# EAGLE design temoin (EAGLE 9.6.2)
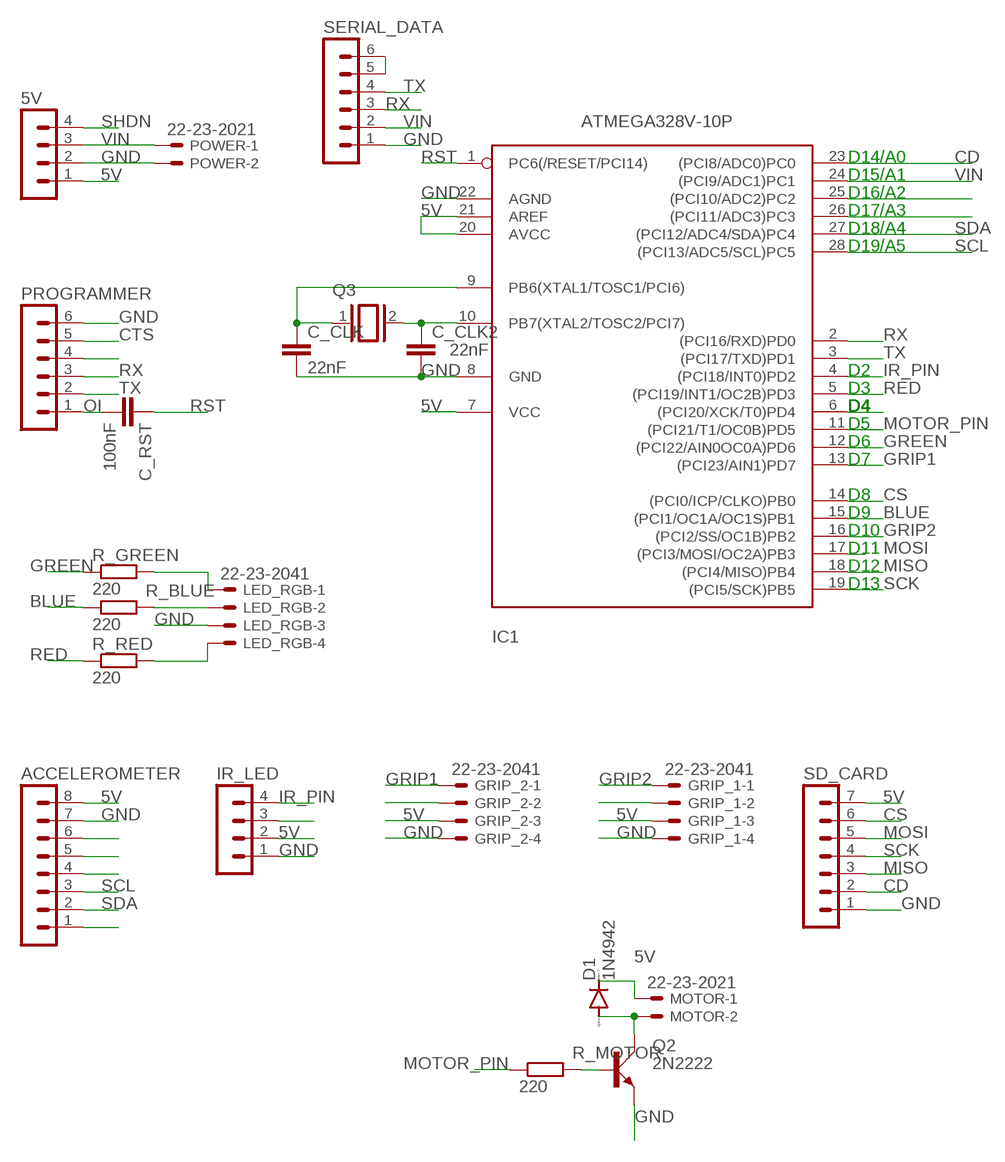
[diagram p0: schematic, sheet 1]

## Parts
5V  MA04-1  [MA04-1]
ACCELEROMETER  MA08-1  [MA08-1]
C_CLK  22nF  C-EU025-025X050  [C025-025X050]
C_CLK2  22nF  C-EU025-025X050  [C025-025X050]
C_RST  100nF  C-EU025-040X050  [C025-040X050]
D1  1N4942  [DO41-10]
GRIP_1  22-23-2041  [22-23-2041]
GRIP_2  22-23-2041  [22-23-2041]
IC1  ATMEGA328V-10P  [DIL28-3]
IR_LED  MA04-1  [MA04-1]
LED_RGB  22-23-2041  [22-23-2041]
MOTOR  22-23-2021  [22-23-2021]
POWER  22-23-2021  [22-23-2021]
PROGRAMMER  MA06-1  [MA06-1]
Q2  2N2222  [TO18A]
Q3  XTAL/S  [QS]
R_BLUE  220  R-EU_0411/12  [0411/12]
R_GREEN  220  R-EU_0411/12  [0411/12]
R_MOTOR  220  R-EU_0411/12  [0411/12]
R_RED  220  R-EU_0411/12  [0411/12]
SD_CARD  MA07-1  [MA07-1]
SERIAL_DATA  MA06-1  [MA06-1]

## Nets
5V: 5V.1 ACCELEROMETER.8 D1.C GRIP_1.3 GRIP_2.3 IC1.7(VCC) IC1.20(AVCC) IC1.21(AREF) IR_LED.2 MOTOR.1 SD_CARD.7
BLUE: IC1.15((PCI1/OC1A/OC1S)PB1) R_BLUE.1
CD: IC1.23((PCI8/ADC0)PC0) SD_CARD.2
CS: IC1.14((PCI0/ICP/CLKO)PB0) SD_CARD.6
CTS: PROGRAMMER.5
GND: 5V.2 ACCELEROMETER.7 C_CLK2.2 C_CLK.2 GRIP_1.4 GRIP_2.4 IC1.8(GND) IC1.22(AGND) IR_LED.1 LED_RGB.3 POWER.2 PROGRAMMER.6 Q2.E SD_CARD.1 SERIAL_DATA.1
GREEN: IC1.12((PCI22/AIN0OC0A)PD6) R_GREEN.1
GRIP1: GRIP_2.1 IC1.13((PCI23/AIN1)PD7)
GRIP2: GRIP_1.1 IC1.16((PCI2/SS/OC1B)PB2)
IR_PIN: IC1.4((PCI18/INT0)PD2) IR_LED.4
MISO: IC1.18((PCI4/MISO)PB4) SD_CARD.3
MOSI: IC1.17((PCI3/MOSI/OC2A)PB3) SD_CARD.5
MOTOR_PIN: IC1.11((PCI21/T1/OC0B)PD5) R_MOTOR.1
N$1: LED_RGB.2 R_BLUE.2
N$2: SERIAL_DATA.5 SERIAL_DATA.6
N$4: IC1.25((PCI10/ADC2)PC2)
N$5: IC1.26((PCI11/ADC3)PC3)
N$8: D1.A MOTOR.2 Q2.C
N$10: PROGRAMMER.4
N$13: Q2.B R_MOTOR.2
N$14: IC1.6((PCI20/XCK/T0)PD4)
N$16: ACCELEROMETER.6
N$17: ACCELEROMETER.5
N$18: ACCELEROMETER.4
N$21: ACCELEROMETER.1
N$23: GRIP_1.2
N$27: GRIP_2.2
N$30: C_CLK2.1 IC1.10(PB7(XTAL2/TOSC2/PCI7)) Q3.2
N$32: LED_RGB.1 R_GREEN.2
N$33: LED_RGB.4 R_RED.2
N$36: C_CLK.1 IC1.9(PB6(XTAL1/TOSC1/PCI6)) Q3.1
N$37: IR_LED.3
OI: C_RST.2 PROGRAMMER.1
RED: IC1.5((PCI19/INT1/OC2B)PD3) R_RED.1
RST: C_RST.1 IC1.1(PC6(/RESET/PCI14))
RX: IC1.2((PCI16/RXD)PD0) PROGRAMMER.3 SERIAL_DATA.3
SCK: IC1.19((PCI5/SCK)PB5) SD_CARD.4
SCL: ACCELEROMETER.3 IC1.28((PCI13/ADC5/SCL)PC5)
SDA: ACCELEROMETER.2 IC1.27((PCI12/ADC4/SDA)PC4)
SHDN: 5V.4
TX: IC1.3((PCI17/TXD)PD1) PROGRAMMER.2 SERIAL_DATA.4
VIN: 5V.3 IC1.24((PCI9/ADC1)PC1) POWER.1 SERIAL_DATA.2

## Notes on the sheet
- D14/A0
- D15/A1
- D16/A2
- D17/A3
- D18/A4
- D19/A5
- D2
- D3
- D4 | D4 | D4 | D4 | D4
- D5
- D6
- D7
- D8
- D9
- D10
- D11
- D12
- D13

## Library data of the parts
5V IR_LED = con-lstb:MA04-1: PIN HEADER; OC_FARNELL: unknown; OC_NEWARK: unknown
ACCELEROMETER = con-lstb:MA08-1: PIN HEADER; OC_FARNELL: unknown; OC_NEWARK: unknown
C_CLK C_CLK2 C_RST = rcl:C-EU: CAPACITOR, European symbol; SPICEPREFIX: C
D1 = diode:1N4942: DIODE 1.0 A, 200 V, 150 ns
GRIP_1 GRIP_2 LED_RGB = con-molex:22-23-2041: .100" (2.54mm) Center Header - 4 Pin; MF: MOLEX; MPN: 22-23-2041; OC_FARNELL: 1462920; OC_NEWARK: 38C0355
IC1 = atmega328:ATMEGA328*P: MICROCONTROLLER 32 kBytes FLASH 2 kBytes SRAM 1 kBytes EEPROM USART 8-channel 10 bit ADC
MOTOR POWER = con-molex:22-23-2021: .100" (2.54mm) Center Header - 2 Pin; MF: MOLEX; MPN: 22-23-2021; OC_FARNELL: 1462926; OC_NEWARK: 25C3832
PROGRAMMER SERIAL_DATA = con-lstb:MA06-1: PIN HEADER; OC_FARNELL: unknown; OC_NEWARK: unknown
Q2 = transistor-small-signal:2N2222: NPN TRANSISTOR
Q3 = special:XTAL/S: CRYSTAL
R_BLUE R_GREEN R_MOTOR R_RED = rcl:R-EU_: RESISTOR, European symbol; SPICEPREFIX: R
SD_CARD = con-lstb:MA07-1: PIN HEADER; OC_FARNELL: unknown; OC_NEWARK: unknown

## Board
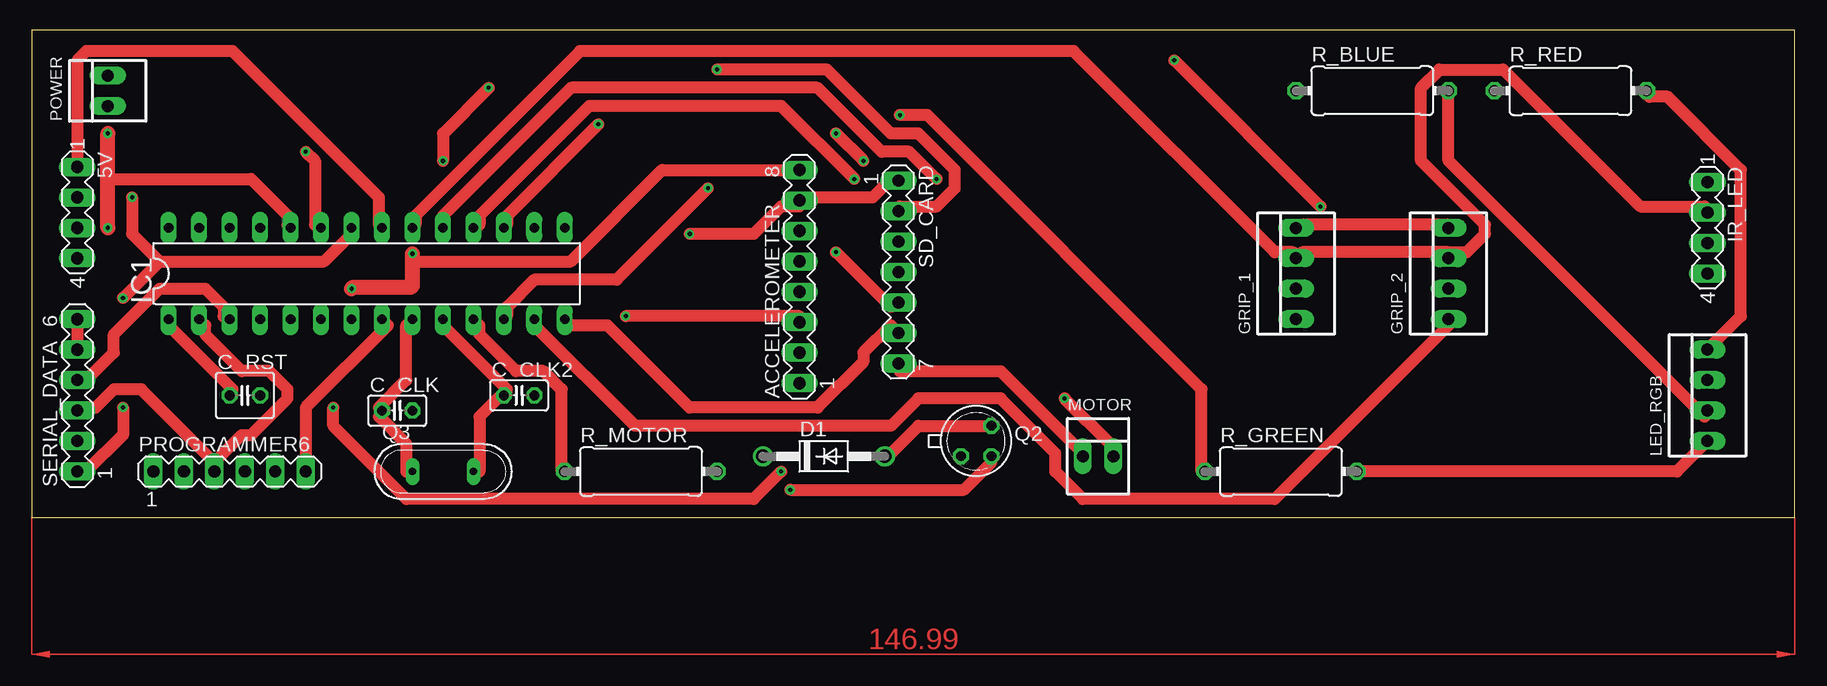
[diagram p1: board, top side]
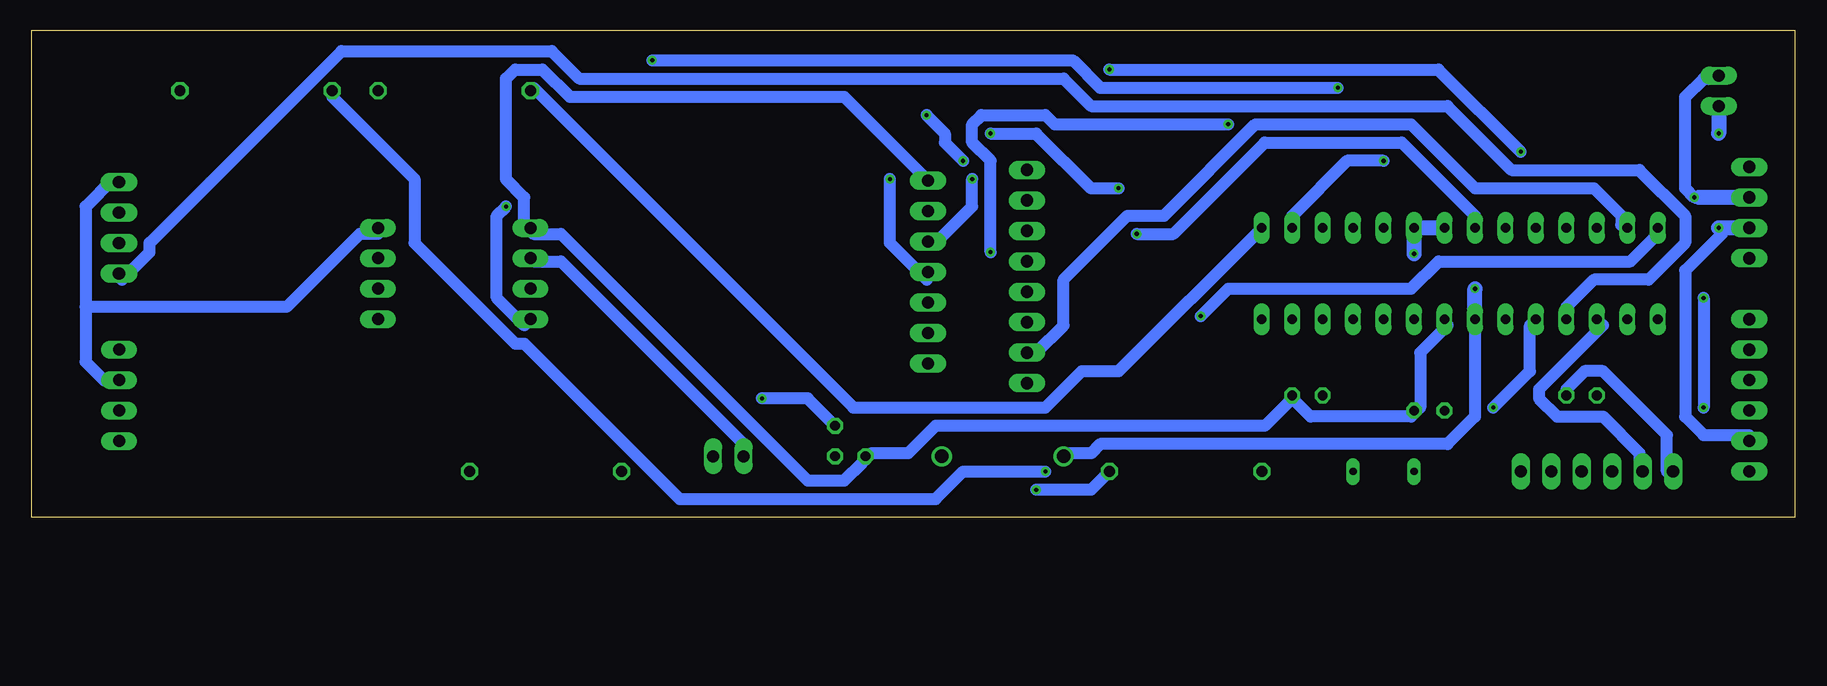
[diagram p2: board, bottom side, seen from below]

Size 146.99 x 40.63 mm. Coordinates in mm from the lower left corner, seen from the top.
Outline: 0,0 146.99,0 146.99,40.63 0,40.63 0,0
Copper layers (1*16): Top 0.035mm / dielectric 1.5mm / Bottom 0.035mm
Design rules "default *": minimum track width 40mil, minimum drill 0.35mm, track to track 20mil, track to pad 20mil, pad to pad 20mil, via to via 20mil, smd to smd 20mil, copper to edge 40mil, drill to drill 10mil, minimum pad ring 10mil, minimum via ring 8mil, stop-mask expansion 4mil, vias tented up to drill 0mil, thermal gap 10mil

### Footprints (pad centres in the part's own frame; a part is rotated, then mirrored left to right if it is on the bottom)
MA04-1 = drill 1.016 long: 1 -3.81,0; 2 -1.27,0; 3 1.27,0; 4 3.81,0
MA08-1 = drill 1.016 long: 1 -8.89,0; 2 -6.35,0; 3 -3.81,0; 4 -1.27,0; 5 1.27,0; 6 3.81,0; 7 6.35,0; 8 8.89,0
C025-025X050 = drill 0.813 octagon: 1 -1.27,0; 2 1.27,0
C025-040X050 = drill 0.813 octagon: 1 -1.27,0; 2 1.27,0
DO41-10 = drill 1.118: A 5.08,0; C -5.08,0
22-23-2041 = drill 1 long: 1 -3.81,0; 2 -1.27,0; 3 1.27,0; 4 3.81,0
DIL28-3 = drill 0.813 long: 1 -16.51,-3.81; 2 -13.97,-3.81; 3 -11.43,-3.81; 4 -8.89,-3.81; 5 -6.35,-3.81; 6 -3.81,-3.81; 7 -1.27,-3.81; 8 1.27,-3.81; 9 3.81,-3.81; 10 6.35,-3.81; 11 8.89,-3.81; 12 11.43,-3.81; 13 13.97,-3.81; 14 16.51,-3.81; 15 16.51,3.81; 16 13.97,3.81; 17 11.43,3.81; 18 8.89,3.81; 19 6.35,3.81; 20 3.81,3.81; 21 1.27,3.81; 22 -1.27,3.81; 23 -3.81,3.81; 24 -6.35,3.81; 25 -8.89,3.81; 26 -11.43,3.81; 27 -13.97,3.81; 28 -16.51,3.81
22-23-2021 = drill 1 long: 1 -1.27,0; 2 1.27,0
MA06-1 = drill 1.016 long: 1 -6.35,0; 2 -3.81,0; 3 -1.27,0; 4 1.27,0; 5 3.81,0; 6 6.35,0
TO18A = drill 0.813 octagon: B 1.27,-1.27; C 1.27,1.27; E -1.27,-1.27
QS = drill 0.61 long: 1 -2.54,0; 2 2.54,0
0411/12 = drill 0.914 octagon: 1 -6.35,0; 2 6.35,0
MA07-1 = drill 1.016 long: 1 -7.62,0; 2 -5.08,0; 3 -2.54,0; 4 0,0; 5 2.54,0; 6 5.08,0; 7 7.62,0

### Placement (x,y rotation side)
5V  3.81,25.4 270 top
ACCELEROMETER  64.01,20.07 90 top
C_CLK  30.48,8.89 0 top
C_CLK2  40.64,10.16 0 top
C_RST  17.78,10.16 0 top
D1  66.04,5.08 0 top
GRIP_1  105.41,20.32 90 top
GRIP_2  118.11,20.32 90 top
IC1  27.94,20.32 0 top
IR_LED  139.7,24.13 270 top
LED_RGB  139.7,10.16 90 top
MOTOR  88.9,5.08 0 top
POWER  6.35,35.56 90 top
PROGRAMMER  16.51,3.81 0 top
Q2  78.74,6.35 0 top
Q3  34.29,3.81 0 top
R_BLUE  111.76,35.56 0 top
R_GREEN  104.14,3.81 0 top
R_MOTOR  50.8,3.81 0 top
R_RED  128.27,35.56 0 top
SD_CARD  72.26,20.45 270 top
SERIAL_DATA  3.81,10.16 90 top

### Tracks (layer width: path | path; a pad name or v marks a point on that pad's centre or on a via)
5V  (via drill 0.35)
  Top 1.016: 5V.1 3.81,38.1 4.57,38.86 16.76,38.86 28.96,26.67 28.96,24.38 IC1.21 | ACCELEROMETER.8 52.58,28.96 44.96,21.34 31.75,21.34 | MOTOR.1 87.63,5.33 80.77,12.19 72.39,12.19 SD_CARD.7 | 118.11,22.1 105.92,22.1 GRIP_1.3 105.16,22.1 103.63,22.1 86.87,38.86 45.72,38.86 32,25.15 32,24.38 IC1.20 | 118.11,22.1 119.63,22.1 121.16,23.62 121.16,24.38 115.82,29.72 115.82,35.81 117.35,37.34 122.68,37.34 134.11,25.91 139.45,25.91 IR_LED.2 | 118.11,22.1 GRIP_2.3
  Top 1.27: v26.67,19.05 26.8,19.18 31.62,19.18 31.75,19.3 31.75,21.34 v31.75,21.97
  Bottom 1.016: IC1.7 26.67,8.38 28.96,6.1 57.91,6.1 58.67,5.33 60.96,5.33 D1.C | MOTOR.1 87.63,6.1 102.87,21.34 105.16,21.34 GRIP_1.3
  Bottom 1.27: IC1.7 v26.67,19.05 | IC1.21 IC1.20 v31.75,21.97
BLUE
  Bottom 1.016: IC1.15 56.39,12.19 59.44,12.19 62.48,9.14 78.49,9.14 105.16,35.81 R_BLUE.1
CD  (via drill 0.35)
  Top 1.016: v22.86,30.48 23.62,29.72 23.62,24.38 IC1.23 | v57.15,37.34 66.29,37.34 71.63,32 73.91,32 76.96,28.96 76.96,27.43 75.44,25.91 72.39,25.91 SD_CARD.2
  Bottom 1.016: v22.86,30.48 29.72,37.34 v57.15,37.34
CS
  Top 1.016: IC1.14 44.96,16 48.01,16 54.86,9.14 65.53,9.14 69.34,12.95 69.34,13.72 71.63,16 SD_CARD.6
GND  (via drill 0.35)
  Top 1.016: PROGRAMMER.6 22.86,9.14 29.72,16 IC1.8 | 10.67,21.34 24.38,21.34 26.67,23.62 IC1.22 | 10.67,21.34 8.38,23.62 v8.38,26.67 | SERIAL_DATA.1 4.57,3.81 7.62,6.86 v7.62,9.14 | 10.67,21.34 v7.62,18.29 | SD_CARD.1 71.63,28.19 70.1,26.67 64.01,26.67 ACCELEROMETER.7 64.01,25.91 62.48,25.91 60.2,23.62 v54.86,23.62 | GRIP_1.4 105.92,24.38 118.11,24.38 GRIP_2.4
  Bottom 1.016: IC1.8 28.96,16 31.24,13.72 31.24,9.14 C_CLK.2 32,8.38 40.39,8.38 41.91,9.91 | 41.91,9.91 44.2,7.62 71.63,7.62 73.91,5.33 76.96,5.33 Q2.E 77.72,4.57 79.25,3.05 82.3,3.05 102.87,23.62 105.16,23.62 GRIP_1.4 105.92,24.38 105.92,26.67 107.44,28.19 107.44,36.58 106.68,37.34 104.39,37.34 102.11,35.05 79.25,35.05 SD_CARD.1 | 41.91,9.91 C_CLK2.2 | 8,26.67 v8.38,26.67 9.14,27.43 9.14,35.05 7.62,36.58 6.86,36.58 POWER.2 | v7.62,18.29 v7.62,9.14 | LED_RGB.3 140.97,11.43 142.49,12.95 142.49,17.53 | 142.49,17.53 142.49,25.91 140.21,28.19 IR_LED.1 | 142.49,17.53 125.73,17.53 119.63,23.62 118.11,23.62 GRIP_2.4 | IC1.22 26.67,25.15 32.77,31.24 44.2,31.24 51.82,23.62 v54.86,23.62
  Bottom 1.27: 5V.2 8,26.67
GREEN  (via drill 0.35)
  Top 1.016: v56.39,27.43 48.77,19.81 41.91,19.81 39.62,17.53 39.62,16.76 IC1.12 | v69.34,29.72 v67.06,32 | v72.39,33.53 74.68,33.53 97.54,10.67 97.54,3.81 R_GREEN.1
  Bottom 1.016: v56.39,27.43 58.67,27.43 63.25,32 v67.06,32 | v69.34,29.72 70.87,31.24 70.87,32 v72.39,33.53
GRIP1
  Top 1.016: IC1.13 41.91,16 50.29,7.62 71.63,7.62 73.91,9.91 80.77,9.91 85.34,5.33 85.34,3.81 87.63,1.52 103.63,1.52 118.11,16 GRIP_2.1
GRIP2  (via drill 0.35)
  Top 1.016: v34.29,29.72 34.29,32 v38.1,35.81 | v107.44,25.91 v95.25,38.1
  Bottom 1.016: IC1.16 41.91,25.15 37.34,29.72 v34.29,29.72 | v38.1,35.81 57.91,35.81 60.2,38.1 v95.25,38.1 | v107.44,25.91 108.2,25.15 108.2,18.29 105.92,16 GRIP_1.1
IR_PIN
  Bottom 1.016: IC1.4 19.05,17.53 16.76,19.81 12.19,19.81 9.14,22.86 9.14,25.15 12.95,28.96 23.62,28.96 28.96,34.29 58.67,34.29 60.96,36.58 101.35,36.58 103.63,38.86 121.16,38.86 137.16,22.86 137.16,22.1 139.45,19.81 IR_LED.4
MISO  (via drill 0.35)
  Top 1.016: v68.58,28.19 62.48,34.29 46.48,34.29 37.34,25.15 37.34,24.38 IC1.18
  Bottom 1.016: v68.58,28.19 68.58,25.91 71.63,22.86 SD_CARD.3
MOSI  (via drill 0.35)
  Top 1.016: v47.24,32.77 39.62,25.15 39.62,24.38 IC1.17 | v67.06,22.1 71.63,17.53 SD_CARD.5
  Bottom 1.016: v47.24,32.77 61.72,32.77 62.48,33.53 67.82,33.53 68.58,32.77 68.58,31.24 67.06,29.72 v67.06,22.1
MOTOR_PIN
  Top 1.016: IC1.11 37.34,16 37.34,15.24 40.39,12.19 42.67,12.19 44.2,10.67 44.2,3.81 R_MOTOR.1
N$1
  Top 1.016: R_BLUE.2 118.11,29.72 139.45,8.38 LED_RGB.2
N$2
  Top 1.016: SERIAL_DATA.6 SERIAL_DATA.5
N$8  (via drill 0.35)
  Top 1.016: Q2.C 73.91,7.62 71.63,5.33 D1.A | v86.11,9.91 89.92,6.1 89.92,5.33 MOTOR.2
  Bottom 1.016: v86.11,9.91 82.3,9.91 Q2.C
N$13  (via drill 0.35)
  Top 1.016: v63.25,2.29 77.72,2.29 80.01,4.57 Q2.B
  Bottom 1.016: v63.25,2.29 58.67,2.29 R_MOTOR.2
N$30
  Top 1.016: Q3.2 37.34,3.81 37.34,8.38 38.86,9.91 C_CLK2.1 39.62,10.67 34.29,16 IC1.10
N$32
  Top 1.016: R_GREEN.2 137.16,3.81 LED_RGB.1
N$33
  Top 1.016: LED_RGB.4 142.49,16.76 142.49,28.96 136.4,35.05 134.87,35.05 R_RED.2
N$36
  Top 1.016: Q3.1 31.24,3.81 31.24,6.1 28.96,8.38 C_CLK.1 28.96,9.14 31.24,11.43 31.24,16 IC1.9
OI
  Bottom 1.016: C_RST.2 19.05,10.67 17.53,12.19 16,12.19 10.67,6.86 10.67,3.81 PROGRAMMER.1
RED  (via drill 0.35)
  Top 1.016: v25.15,9.14 25.15,7.62 31.24,1.52 60.2,1.52 v62.48,3.81
  Bottom 1.016: v25.15,9.14 22.1,12.19 22.1,16 IC1.5 | v62.48,3.81 69.34,3.81 71.63,1.52 92.96,1.52 105.92,14.48 106.68,14.48 115.06,22.86 115.06,28.19 121.92,35.05 R_RED.1
RST
  Top 1.016: IC1.1 11.43,16 16.76,10.67 C_RST.1
RX
  Top 1.016: 15.24,4.57 17.53,6.86 18.29,6.86 21.34,9.91 21.34,10.67 19.81,12.19 17.53,12.19 14.48,15.24 14.48,16 IC1.2 | 15.24,4.57 9.14,10.67 6.86,10.67 5.33,9.14 3.81,9.14 SERIAL_DATA.3 | 15.24,4.57 PROGRAMMER.3
SCK  (via drill 0.35)
  Top 1.016: IC1.19 34.29,25.15 44.96,35.81 65.53,35.81 70.87,30.48 73.15,30.48 v75.44,28.19
  Bottom 1.016: v75.44,28.19 75.44,22.86 72.39,19.81 SD_CARD.4
SCL  (via drill 0.35)
  Top 1.016: v49.53,16.76 64.01,16.76 ACCELEROMETER.3
  Bottom 1.016: v49.53,16.76 47.24,19.05 32,19.05 29.72,21.34 13.72,21.34 11.43,23.62 IC1.28
SDA
  Bottom 1.016: ACCELEROMETER.2 63.25,13.72 60.96,16 60.96,19.81 55.63,25.15 52.58,25.15 44.96,32.77 32,32.77 26.67,27.43 16.76,27.43 14.48,25.15 14.48,24.38 IC1.27
TX
  Top 1.016: SERIAL_DATA.4 4.57,11.43 6.86,13.72 6.86,15.24 10.67,19.05 14.48,19.05 16,17.53 16,16.76 IC1.3
  Bottom 1.016: PROGRAMMER.2 12.95,3.81 12.95,5.33 16,8.38 19.81,8.38 21.34,9.91 21.34,10.67 16,16 IC1.3
VIN  (via drill 0.35)
  Top 1.016: 6.35,28.19 18.29,28.19 21.34,25.15 21.34,24.38 IC1.24
  Top 1.27: v6.35,24.13 6.35,28.19 v6.35,32
  Bottom 1.016: SERIAL_DATA.2 3.81,6.86 7.62,6.86 9.14,8.38 9.14,20.57 6.1,23.62 6.1,24.13
  Bottom 1.27: POWER.1 v6.35,32 | 5V.3 6.1,24.13 v6.35,24.13
(copper drawn outside any net)
  shapes: Top area x2